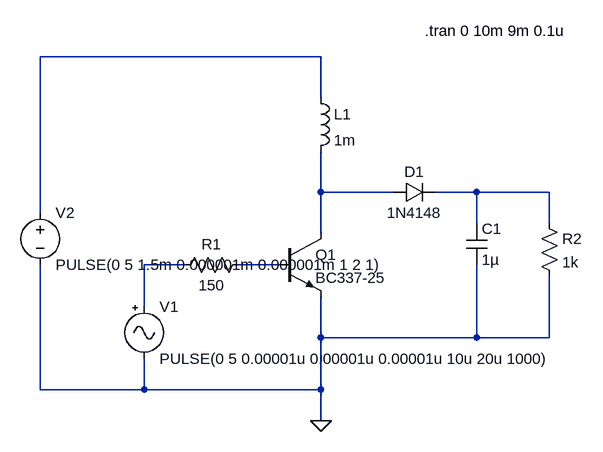
[diagram p0: schematic CircuitoBoost.asc]
CircuitoBoost.asc, the LTspice schematic file:
Version 4
SHEET 1 1304 680
WIRE 208 -144 -224 -144
WIRE 208 -80 208 -144
WIRE 208 64 208 0
WIRE 320 64 208 64
WIRE 448 64 384 64
WIRE 560 64 448 64
WIRE -224 96 -224 -144
WIRE 448 112 448 64
WIRE 560 112 560 64
WIRE 208 128 208 64
WIRE 0 176 -64 176
WIRE 144 176 80 176
WIRE -64 240 -64 176
WIRE 208 288 208 224
WIRE 448 288 448 176
WIRE 448 288 208 288
WIRE 560 288 560 192
WIRE 560 288 448 288
WIRE -224 368 -224 176
WIRE -64 368 -64 320
WIRE -64 368 -224 368
WIRE 208 368 208 288
WIRE 208 368 -64 368
WIRE 208 416 208 368
FLAG 208 416 0
SYMBOL npn 144 128 R0
SYMATTR InstName Q1
SYMATTR Value BC337-25
SYMBOL res 96 160 R90
WINDOW 0 0 56 VBottom 2
WINDOW 3 32 56 VTop 2
SYMATTR InstName R1
SYMATTR Value 150
SYMBOL diode 320 80 R270
WINDOW 0 32 32 VTop 2
WINDOW 3 0 32 VBottom 2
SYMATTR InstName D1
SYMATTR Value 1N4148
SYMBOL cap 432 112 R0
SYMATTR InstName C1
SYMATTR Value 1µ
SYMBOL res 544 96 R0
SYMATTR InstName R2
SYMATTR Value 1k
SYMBOL ind 192 -96 R0
SYMATTR InstName L1
SYMATTR Value 1m
SYMBOL Misc\\signal -64 224 R0
WINDOW 123 0 0 Left 2
WINDOW 39 0 0 Left 2
SYMATTR InstName V1
SYMATTR Value PULSE(0 5 0.00001u 0.00001u 0.00001u 10u 20u 1000)
SYMBOL voltage -224 80 R0
WINDOW 123 0 0 Left 2
WINDOW 39 0 0 Left 2
SYMATTR InstName V2
SYMATTR Value PULSE(0 5 1.5m 0.000001m 0.000001m 1 2 1)
TEXT 368 -184 Left 2 !.tran 0 10m 9m 0.1u

The netlist it stands for:
* CircuitoBoost.asc
Q1 N002 N005 0 0 BC337-25
R1 N005 N004 150
D1 N002 N003 1N4148
C1 N003 0 1µ
R2 N003 0 1k
L1 N001 N002 1m
V1 N004 0 PULSE(0 5 0.00001u 0.00001u 0.00001u 10u 20u 1000)
V2 N001 0 PULSE(0 5 1.5m 0.000001m 0.000001m 1 2 1)
.model D D
.lib standard.dio
.model NPN NPN
.model PNP PNP
.lib standard.bjt
.tran 0 10m 9m 0.1u
.backanno
.end